# Altium project hotair.PrjPCB
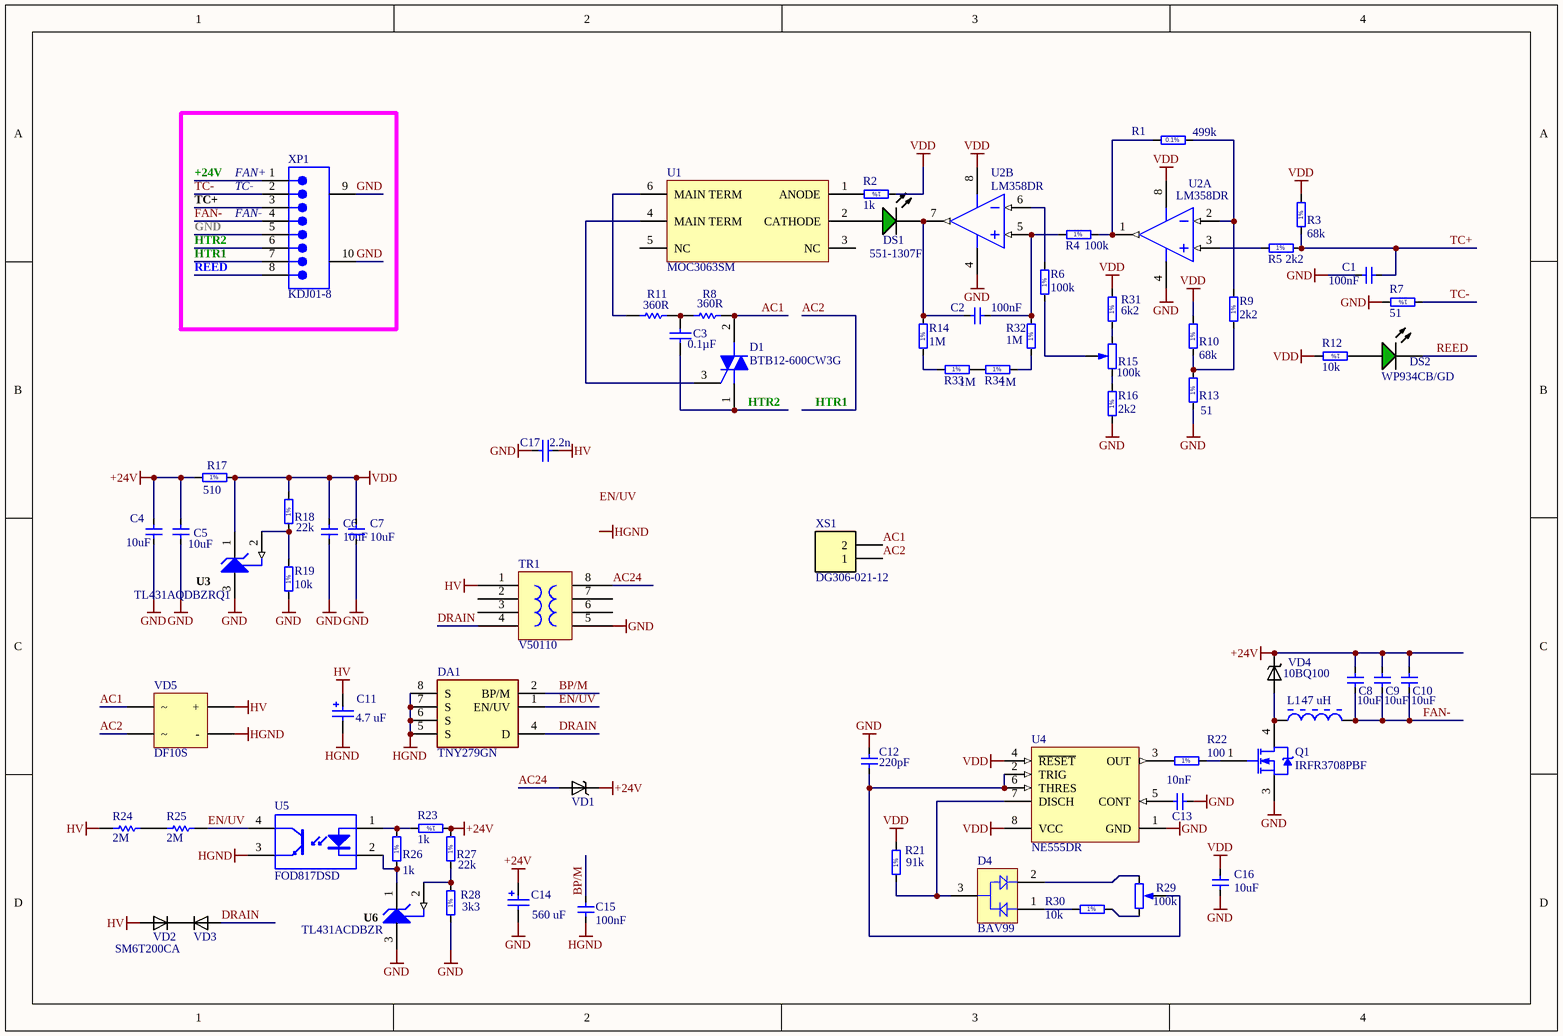
[diagram p0: hotair.SchDoc]
1 sheet, 71 parts. Net scope: global (net labels, ports and power ports of the same name join across sheets).
Board files: hotair.PcbDoc, hotair_panel.PcbDoc

## Sheet hotair.SchDoc
size A4

### Parts
C1  100nF  [CAP0805R]
C2  100nF  [CAP0805R]
C3  Capacitance: 0.1µF  [CAPA55-380X260]  (hidden comment: A104M15X7RF5TAA)
C4  10uF  [CAP0805R]
C5  10uF  [CAP0805R]
C6  10uF  [CAP0805R]
C7  10uF  [CAP0805R]
C8  10uF  [CAP1206R]
C9  10uF  [CAP1206R]
C10  10uF  [CAP1206R]
C11  value 4.7 uF  [WCAP-ATG8_8x11.5x3.5]  (hidden comment: 400 Vdc, 4.7 uF)
C12  220pF  [CAP0805R]
C13  10nF  [CAP0805R]
C14  value 560 uF  [WCAP-ATG8_8x11.5x3.5]  (hidden comment: 10 Vdc, 560 uF)
C15  100nF  [CAP0805R]
C16  10uF  [CAP0805R]
C17  value 2.2n  [CAP_Y]  (hidden comment: Y Capacitor)
D1  BTB12-600CW3G  [ONSC-TO-220-3-221A-07]
D4  BAV99  [INF-SOT23_L]
DA1  TNY279GN  [SMDIP8]
DS1  551-1307F  [DIAL-LED-551-2_V]
DS2  WP934CB/GD  [KING-WP934CBGD_V]
L1  Inductance: 47 uH  [COIL-RFB0807-2_V]  (hidden comment: RFB0807-470L)
Q1  IRFR3708PBF  [INTR-TO-252AA-3_M]
R1  499k  [RES0805R]
R2  1k  [RES0805R]
R3  68k  [RES0805R]
R4  100k  [RES0805R]
R5  2k2  [RES0805R]
R6  100k  [RES0805R]
R7  51  [RES0805R]
R8  360R  [RESC2010(5025)_L]
R9  2k2  [RES0805R]
R10  68k  [RES0805R]
R11  360R  [RESC2010(5025)_L]
R12  10k  [RES0805R]
R13  51  [RES0805R]
R14  1M  [RES0805R]
R15  100k  [CA9MH]
R16  2k2  [RES0805R]
R17  510  [RES0805R]
R18  22k  [RES0805R]
R19  10k  [RES0805R]
R21  91k  [RES0805R]
R22  100  [RES0805R]
R23  1k  [RES0805R]
R24  2M  [RESC1206(3216)_L]
R25  2M  [RESC1206(3216)_L]
R26  1k  [RES0805R]
R27  22k  [RES0805R]
R28  3k3  [RES0805R]
R29  100k  [CA9MH]
R30  10k  [RES0805R]
R31  6k2  [RES0805R]
R32  1M  [RES0805R]
R33  1M  [RES0805R]
R34  1M  [RES0805R]
TR1  V50110  [V50110]
U1  MOC3063SM  [FAIR-MDIP 6L-N06C_V]
U2  LM358DR  [D0008A_L]  (parts A,B of 2)
U3  TL431AQDBZRQ1  [DBZ0003A_M]
U4  NE555DR  [D0008A_M]
U5  FOD817DSD  [FAIR-MDIP-4_V]
U6  TL431ACDBZR  [DBZ0003A_L]
VD1  10BQ100  [DO-214AA]  (value not drawn)
VD2  SM6T200CA  [SMB]
VD3  US1M  [SMA]  (value not drawn)
VD4  10BQ100  [DO-214AA]
VD5  DF10S  [DF-S]
XP1  KDJ01-8  [KDJ01-8]
XS1  DG306-021-12  [DG306]

### Nets
+24V: C4.2 C5.2 C8.2 C9.2 C10.2 C14.1(P) R17.1 R23.1 R27.2 VD1.K VD4.K XP1.1
GND: C1.1 C4.1 C5.1 C6.1 C7.1 C12.2 C13.2 C14.2(N) C16.1 C17.1 Q1.3(S) R7.2 R13.1 R16.1 R19.1 R28.1 TR1.5 U2.4(GND) U3.3(ANODE) U4.1(GND) U6.3(ANODE) XP1.5 XP1.9 XP1.10
HGND: C11.2(N) C15.1 DA1.5(S) DA1.6(S) DA1.7(S) DA1.8(S) U5.3(EMITTER) VD5.2(-)
HV: C11.1(P) C17.2 R24.1 TR1.1 VD2.A VD5.1(+)
VDD: C6.2 C7.2 C16.2 R2.1 R3.2 R10.2 R12.2 R17.2 R18.2 R21.2 R31.2 U2.8(VCC) U3.1(CATHODE) U4.4(~{RESET}) U4.8(VCC)
AC1: D1.2(MT2) R8.2 VD5.4 XS1.2
AC2: VD5.3 XP1.7 XS1.1  [also labelled HTR1]
AC24: TR1.8 VD1.A
BP/M: C15.2 DA1.2(BP/M)
DRAIN: DA1.4(D) TR1.4 VD3.A
EN/UV: DA1.1(EN/UV) R25.2 U5.4(COLLECTOR)
FAN-: C8.1 C9.1 C10.1 L1.2 XP1.4
HTR2: C3.1 D1.1(MT1) XP1.6
REED: DS2.1(K) XP1.8
TC+: C1.2 R3.1 R5.2 XP1.3
TC-: R7.1 XP1.2
NetC2_1: C2.1 DS1.2(K) R14.2 U2.7(2OUT)
NetC2_2: C2.2 R4.1 R32.2 U2.5(2IN+)
NetC3_2: C3.2 R8.1 R11.2
NetC12_1: C12.1 R29.2 U4.2(TRIG) U4.6(THRES)
NetC13_1: C13.1 U4.5(CONT)
NetD1_3: D1.3(G) U1.4(MAIN_TERM)
NetD4_1: D4.1(A1) R30.1
NetD4_2: D4.2(K2) R29.1
NetD4_3: D4.3(C) R21.1 U4.7(DISCH)
NetDS1_1: DS1.1(A) U1.2(CATHODE)
NetDS2_2: DS2.2(A) R12.1
NetL1_1: L1.1 Q1.4(D) VD4.A
NetQ1_1: Q1.1(G) R22.2
NetR1_1: R1.1 R4.2 U2.1(1OUT)
NetR1_2: R1.2 R9.2 U2.2(1IN-)
NetR2_2: R2.2 U1.1(ANODE)
NetR5_1: R5.1 U2.3(1IN+)
NetR6_1: R6.1 R15.2
NetR6_2: R6.2 U2.6(2IN-)
NetR9_1: R9.1 R10.1 R13.2
NetR11_1: R11.1 U1.6(MAIN_TERM)
NetR14_1: R14.1 R33.1
NetR15_1: R15.1 R31.1
NetR15_3: R15.3 R16.2
NetR18_1: R18.1 R19.2 U3.2(REF)
NetR22_1: R22.1 U4.3(OUT)
NetR23_2: R23.2 R26.2 U5.1(ANODE)
NetR24_2: R24.2 R25.1
NetR26_1: R26.1 U5.2(CATHODE) U6.1(CATHODE)
NetR27_1: R27.1 R28.2 U6.2(REF)
NetR29_3: R29.3 R30.2
NetR32_1: R32.1 R34.2
NetR33_2: R33.2 R34.1
NetVD2_K: VD2.K VD3.K

Not connected (* = marked no-connect by the designer): TR1 2 3 6 7; U1 3(NC) 5(NC)

### Notes on the sheet
- (near XP1) FAN+
- (near XP1) TC-
- (near XP1) FAN-
- Labels drawn without touching a wire or pin: EN/UV, HGND
- (in symbol R0805_1K_1%_0.125W_100PPM) 1%
- (in symbol R0805_1M_1%_0.125W_100PPM) 1%
- (in symbol R0805_2K2_1%_0.125W_100PPM) 1%
- (in symbol R0805_3K3_1%_0.125W_100PPM) 1%
- (in symbol R0805_6K2_1%_0.125W_100PPM) 1%
- (in symbol R0805_10K_1%_0.125W_100PPM) 1%
- (in symbol R0805_22K_1%_0.125W_100PPM) 1%
- (in symbol R0805_51R_1%_0.125W_100PPM) 1%
- (in symbol R0805_68K_1%_0.125W_100PPM) 1%
- (in symbol R0805_91K_1%_0.125W_100PPM) 1%
- (in symbol R0805_100K_1%_0.125W_100PPM) 1%
- (in symbol R0805_100R_1%_0.125W_100PPM) 1%
- (in symbol R0805_499K_0.1%_0.125W_25PPM) 0.1%
- (in symbol R0805_510R_1%_0.125W_100PPM) 1%

### Library data of the parts
C1 C2 C15 = CC0805_100NF_50V_10%_X7R: Part Description: SMD Multilayer Chip Ceramic Capacitor; Manufacturer: GENERIC; Manufacturer1 Part Number: B37941K5104K62; Voltage: 50V; TC: X7R; Tolerance: ±10%; Table: Capacitors SMD; Part Number: CC0805_100NF_50V_10%_X7R; Component Kind: Standard; Component Type: Standard; Pin Count: 2; Value: 100nF; Status: Preferred; Manufacturer Part Number: CC0805_100NF_50V_10%_X7R; Case: 0805; Mounted: Yes; Socket: No; SMD: Yes; Manufacturer1 Example: EPCOS; Manufacturer1 ComponentHeight: 1.35mm; HelpURL: \\cern.ch\dfs\Applications\Altium\Datasheets\CC0805_X7R_EPCOS.pdf; Author: I. Kuznetsov; CreateDate: 03.12.2007; LatestRevisionDate: 03.12.2007; Manufacturer Part Number 2: CC0805KPX7R9BB104
C3 = CMP-2000-05716-1: Axial Leaded Multilayer Ceramic Capacitor for General Purpose, 50 VDC, 100 nF, +/- 20%, -55 to 125 degC, 2-Pin THD, RoHS, Tape and Reel; Manufacturer: Vishay; Voltage - Rated: 50V; Temperature Coefficient: X7R; Lead Spacing: -; Lead Style: -; Height - Seated (Max): -; Standard Package: 7,000; Datasheet Version: 08/2013; Datasheet URL: http://www.vishay.com/docs/45164/aseries.pdf; Package Description: 2-Pin Axial Lead, Dia 2.6 mm, Body Length 3.8 mm; Manufacturer URL: http://www.vishay.com/; Category: Capacitors; Mounting Technology: ThroughHole; Size / Dimension: 0.098"Diax0.150"L(2.50mmx3.80mm); Packaging: Tape&Reel(TR); Family: CeramicCapacitors; Applications: GeneralPurpose; Package Reference: CAPA55-380X260; Thickness (Max): -; Series: A; Features: -; Ratings: -; Mounting Type: ThroughHole; Operating Temperature: -55°C~125°C; Tolerance: ±20%; Package / Case: Axial
C4-C7 C16 = CC0805_10UF_25V_10%_X5R: Part Description: SMD Multilayer Chip Ceramic Capacitor; Manufacturer: GENERIC; Manufacturer1 Part Number: C2012X5R1E106K125AB; Voltage: 25V; TC: X5R; Tolerance: ±10%; Table: Capacitors SMD; Part Number: CC0805_10UF_25V_10%_X5R; Component Kind: Standard; Component Type: Standard; Pin Count: 2; Value: 10uF; Status: Preferred; Manufacturer Part Number: CC0805_10UF_25V_10%_X5R; Case: 0805; Mounted: Yes; Socket: No; SMD: Yes; Manufacturer1 Example: TDK; Manufacturer1 ComponentHeight: 1.4mm; HelpURL: \\cern.ch\dfs\Applications\Altium\Datasheets\CC0805_X5R_TDK_C.pdf; Author: I. Kuznetsov; CreateDate: 25.10.2012; LatestRevisionDate: 25.10.2012; Manufacturer Part Number 2: CC0805KKX5R8BB106
C8-C10 = CC1206_10UF_10V_10%_X7R: Part Description: SMD Multilayer Chip Ceramic Capacitor; Manufacturer: GENERIC; Manufacturer1 Part Number: C1206C106K8RAC; Voltage: 10V; TC: X7R; Tolerance: ±10%; Table: Capacitors SMD; Part Number: CC1206_10UF_10V_10%_X7R; Component Kind: Standard; Component Type: Standard; Pin Count: 2; Value: 10uF; Status: Preferred; Manufacturer Part Number: CC1206_10uF_10V_10%_X7R; Case: 1206; Mounted: Yes; Socket: No; SMD: Yes; Manufacturer1 Example: KEMET; Manufacturer1 ComponentHeight: 1.8mm; HelpURL: \\cern.ch\dfs\Applications\Altium\Datasheets\CC1206_X7R_KEMET.pdf; Author: I. Kuznetsov; CreateDate: 03.12.2007; LatestRevisionDate: 03.12.2007; Manufacturer Part Number 2: CC1206KKX7R6BB106
C11 = 860011374005: WCAP-ATG8 Aluminum Electrolytic Capacitors, 8x11.5mm, 400 Vdc, 4.7 uF; Rated Voltage: 400 Vdc; ComponentLink1Description: Manufacturer; ComponentLink1URL: http://www.we-online.de; ComponentLink2Description: Datasheet; ComponentLink2URL: http://katalog.we-online.de/pbs/datasheet/860011374005.pdf; Part Number: 860011374005; Published Date: Sep. 2017; Publisher: Wurth Elektronik; Size: 8x11.5mm; Life Cycle: 2000h; Operating Temperature: -25 °C up to +85 °C
C12 = CC0805_220PF_50V_5%_NP0: Part Description: SMD Multilayer Chip Ceramic Capacitor; Manufacturer: GENERIC; Manufacturer1 Part Number: B37940K5221J060; Voltage: 50V; TC: NP0; Tolerance: ±5%; Table: Capacitors SMD; Part Number: CC0805_220PF_50V_5%_NP0; Component Kind: Standard; Component Type: Standard; Pin Count: 2; Value: 220pF; Status: Preferred; Manufacturer Part Number: CC0805_220PF_50V_5%_NP0; Case: 0805; Mounted: Yes; Socket: No; SMD: Yes; Manufacturer1 Example: EPCOS; Manufacturer1 ComponentHeight: 1.30mm; HelpURL: \\cern.ch\dfs\Applications\Altium\Datasheets\CC0805_NP0_EPCOS.pdf; Author: I. Kuznetsov; CreateDate: 03.12.2007; LatestRevisionDate: 03.12.2007; Manufacturer Part Number 2: CC0805JRNPO9BN221
C13 = CC0805_10NF_250V_10%_X7R: Part Description: SMD Multilayer Chip Ceramic Capacitor; Manufacturer: GENERIC; Manufacturer1 Part Number: C0805C103KARACTU; Voltage: 250V; TC: X7R; Tolerance: ±10%; Table: Capacitors SMD; Part Number: CC0805_10NF_250V_10%_X7R; Component Kind: Standard; Component Type: Standard; Pin Count: 2; Value: 10nF; Status: None; Manufacturer Part Number: CC0805_10NF_250V_10%_X7R; Case: 0805; Mounted: Yes; Socket: No; SMD: Yes; Manufacturer1 Example: KEMET; Manufacturer1 ComponentHeight: 0.88mm; HelpURL: \\cern.ch\dfs\Applications\Altium\Datasheets\CC0805_X7R_KEMET.pdf; Author: I. Kuznetsov; CreateDate: 24.06.2013; LatestRevisionDate: 24.06.2013; Manufacturer Part Number 2: CC0805KKX7RYBB103
C14 = 860010274012: WCAP-ATG8 Aluminum Electrolytic Capacitors, 8x11.5mm, 10 Vdc, 560 uF; Rated Voltage: 10 Vdc; ComponentLink1Description: Manufacturer; ComponentLink1URL: http://www.we-online.de; ComponentLink2Description: Datasheet; ComponentLink2URL: http://katalog.we-online.de/pbs/datasheet/860010274012.pdf; Part Number: 860010274012; Published Date: Sep. 2017; Publisher: Wurth Elektronik; Size: 8x11.5mm; Life Cycle: 2000h; Operating Temperature: -40 °C up to +85 °C
C17 = CAP_Y: PartNumber: Y Film Capacitor; Voltage: 1000V
D1 = CMP-1070-00036-1: Triacs, Silicon Bidirectional Thyristor, 3-Pin TO-220, Pb-Free, Tube; Manufacturer: On Semiconductor; IT(RMS) Max (A): 12; ITSM Max (A): 120; IGT Max (mA): 35; PackageDescription: 3-Pin Flange Mount, Vertical Straight Lead, Body 9.97 x 4.445 mm, Pitch 2.54 mm; ComponentLink2Description: Datasheet; PartNumber: BTB12-600CW3G; ComponentLink2URL: http://www.onsemi.com/pub_link/Collateral/BTB12-600CW3-D.PDF; ComponentLink3Description: Package Specification; Packing: Tube; ComponentLink3URL: http://www.onsemi.com/pub_link/Collateral/221A-07.PDF; ComponentLink1Description: Manufacturer URL; Mounting Technology: Through Hole; RoHS: Pb-Free; PackageVersion: Rev. O, 07/2008; DatasheetVersion: Rev. 1; ComponentLink1URL: http://www.onsemi.com/; PackageReference: TO-220-3-221A-07
D4 = CMP-1176-00014-1: Silicon Switching Diode, SOT23, Reel, Green; Manufacturer: Infineon; Green: TRUE; Mounting Technology: Surface Mount; ComponentLink3URL: http://www.infineon.com/dgdl/smbta14_mmbta14.pdf?folderId=db3a30431441fb5d011445c30f210183&fileId=db3a30431441fb5d011445ef0201018c; PartNumber: BAV99; ComponentLink2Description: Datasheet; ComponentLink2URL: http://www.infineon.com/dgdl/bav99series.pdf?folderId=db3a30431400ef6801141b5844e103ea&fileId=db3a30431400ef6801141c1b237d042f; PackageVersion: Apr-08; PackageDescription: 3-Pin Small Outline Transistor Package, 1.3 x 2.9 mm Body, 0.95 mm Pitch; RevisionNote: Re-Activated Devices; ComponentLink1URL: http://www.infineon.com/; PackageReference: SOT23; ComponentLink1Description: Manufacturer URL; ComponentLink3Description: Package Specification; Packing: Reel
DA1 = TNY279GN: Table: Power; Part Number: TNY279GN; Device: TNY279GN
DS1 = CMP-2000-05095-1: 3mm LED Circuit Board Indicator .200' High LED Centerline, GREEN, 1.9 V, 2 mA, 2-Pin THD, RoHS, Bulk; Manufacturer: Dialight; Product Length (mm): 8.89mm; Number of Elements: 1; Lum Intensity: 1.6mcd; Reverse Voltage: 5V; Test Current (It): 2mA; Peak Wavelength: 565nm; DELETED: Compliant; Viewing Angle: 60deg; Rad Hardened: No; Product Depth (mm): 4.32mm; Power Dissipation: 20W; Emitting Color: YellowGreen; Forward Current: 7mA; Shape Type: Circular; Forward Voltage: 2.2V; Main Category: StandardLED; Product Height (mm): 7.11mm; Lens Type: Diffused; Type: Uni-Color; Manufacturer URL: http://www.dialight.com; Datasheet Version: Jul-02; Luminous Intensity: 1.6mcd; Lens Dimensions: 2.89x2.89x2.54mm; Mounting: ThroughHole; Datasheet URL: http://datasheet.octopart.com/551-1307F-Dialight-datasheet-2832.pdf; High Brightness: No; Pin Count: 2; Operating Temperature Classification: Industrial; Packaging: Bulk; Operating Temp Range: -55Cto100C
DS2 = CMP-2000-07417-1: Right Angle LED Indicator, 62.5 mW, 25 mA, -40 to 85 degC, 2-Pin THD, RoHS, Bulk; Manufacturer: Kingbright; Voltage Rating: 2.2V; Configuration: Single; Other Names: 754-1297 / WP934CBGD; Lens Style/Size: RoundwithDomedTop,3mm; Catalog Drawings: WP934CBSeriesFront / WP934CBSeriesSide; Millicandela Rating: 22.5mcd; Minimum Quantity: Green; 3D Model: WP934CB/x.sldprt / WP934CB/x.pro / WP934CB/x.igs / WP934CB/x.stp; Wavelength - Peak: 568nm; Lens Type: Diffused,Tinted; Dynamic Catalog: SingleLevel3mm(T1)SingleColorRightAngleLEDs; Viewing Angle: 40°; Current: 20mA; Packaging: Bulk; Package Reference: WP934CBGD; Datasheet Version: Rev. 10B, 09/2016; Family: LEDs-CircuitBoardIndicators,Arrays,LightBars,BarGraphs; Manufacturer URL: http://www.kingbright.com/; Standard Package: 500; Mounting Technology: ThroughHole; Quantity Available: Bulk; Category: Optoelectronics; Color: Green; Package Description: 2-Pin Through Hole Device, Body 4.6 x 8.75 mm; Mounting Type: ThroughHole,RightAngle; Datasheet URL: http://www.kingbrightusa.com/images/catalog/SPEC/WP934CB-GD.pdf
L1 = CMP-0924-00047-1: Power Inductor, 47 uH +/- 10%, 1.45 A, -40 to 125 degC, 2-Pin Radial Leaded, Dia 8.8 mm, RoHS, Tray; Manufacturer: Coilcraft; DCR: 0.19 Ohm Max.; Tolerance: +/- 10%; Irms Rise (20 degC): 1.3 A; Isat: 1.45 A; Irms Rise (40 degC): 1.85 A; SRF: 12 MHz Typ.; Mounting Technology: Through Hole; ComponentLink2URL: http://www.coilcraft.com/pdfs/rfb.pdf; PackageDescription: 2-Pin Radial Leaded, Dia 8.8 mm, Height 7.5 mm, Pin Spacing 5 mm; RoHS: TRUE; DatasheetVersion: Sep-13; Packing: Tray; Ambient Temperature Range: -40 to 125 degC; ComponentLink2Description: Datasheet; PartNumber: RFB0807-470L; PackageReference: RFB0807-2; ComponentLink1Description: Manufacturer URL; ComponentLink1URL: http://www.coilcraft.com/
Q1 = CMP-2000-05156-1: Mosfet N-Channel, 30 V, 61 A, -55 to 175 degC, 3-Pin DPAK, RoHS, Tube; Manufacturer: International Rectifier; Voltage Vds Typ: 30V; Power Dissipation Pd: 87W; Rds(on) Test Voltage Vgs: 10V; Transistor Polarity: NChannel; Threshold Voltage Vgs Typ: 2V; Pulse Current Idm: 244A; Junction to Case Thermal Resistance A: 1.73degC/W; On Resistance Rds(on): 13mohm; No. of Pins: 3; Alternate Case Style: D-PAK; On State resistance @ Vgs = 10V: 12.5mohm; SVHC: NoSVHC(19-Dec-2012); Continuous Drain Current Id: 61A; Transistor Case Style: TO-252; Package Reference: TO-252AA-3; Drain Source Voltage Vds: 30V; Datasheet URL: http://www.irf.com/product-info/datasheets/data/irfr3708pbf.pdf; Voltage Vgs Rds on Measurement: 10V; Operating Temperature Min: -55degC; MSL: –; Manufacturer URL: http://internationalrectifier.com/; Voltage Vgs Max: 2V; Operating Temperature Range: -55degCto+175degC; Current Id Max: 61A; Operating Temperature Max: 175degC; Package / Case: DPAK; Package Description: 3-Pin Surface Mount Device, Body 6.54 x 6.095 mm, Pitch 2.29 mm; Datasheet Version: Dec-04
R1 = R0805_499K_0.1%_0.125W_25PPM: Part Description: Thin Film Chip Resistor; Manufacturer: GENERIC; Manufacturer1 Part Number: ERA6AEB4993V; Power: 0.125W; TC: ±25ppm; Tolerance: ±0.1%; Table: Resistors SMD; Part Number: R0805_499K_0.1%_0.125W_25PPM; Component Kind: Standard; Component Type: Standard; Footprint: RESC2012X60N; PackageDescription: Standard; Pin Count: 2; Value: 499k; Status: Not recommended; Manufacturer Part Number: R0805_499K_0.1%_0.125W_25PPM; Case: 0805; Mounted: Yes; Socket: No; SMD: Yes; Manufacturer1 Example: PANASONIC; Manufacturer1 ComponentHeight: 0.6mm; HelpURL: \\cern.ch\dfs\Applications\Altium\Datasheets\R0805_PANASONIC_ERA.pdf; Author: CERN DEM JLC; CreateDate: 20.06.2011; LatestRevisionDate: 20.06.2011
R2 R23 R26 = R0805_1K_1%_0.125W_100PPM: Part Description: General Purpose Thick Film Chip Resistor; Manufacturer: GENERIC; Manufacturer1 Part Number: NRC10F1001TRF; Power: 0.125W; TC: ±100ppm/°C; Tolerance: ±1%; Table: Resistors SMD; Part Number: R0805_1K_1%_0.125W_100PPM; Component Kind: Standard; Component Type: Standard; Footprint: RESC2012X60N; PackageDescription: Standard; Pin Count: 2; Value: 1k; Status: Preferred; Manufacturer Part Number: R0805_1K_1%_0.125W_100PPM; Case: 0805; Mounted: Yes; Socket: No; SMD: Yes; Manufacturer1 Example: NIC COMPONENT; Manufacturer1 ComponentHeight: 0.6mm; HelpURL: \\cern.ch\dfs\Applications\Altium\Datasheets\R0805_NIC_NRC.pdf; Author: CERN DEM JLC; CreateDate: 03.12.2007; LatestRevisionDate: 13.03.2008
R3 R10 = R0805_68K_1%_0.125W_100PPM: Part Description: General Purpose Thick Film Chip Resistor; Manufacturer: GENERIC; Manufacturer1 Part Number: NRC10F6802TRF; Power: 0.125W; TC: ±100ppm/°C; Tolerance: ±1%; Table: Resistors SMD; Part Number: R0805_68K_1%_0.125W_100PPM; Component Kind: Standard; Component Type: Standard; Footprint: RESC2012X60N; PackageDescription: Standard; Pin Count: 2; Value: 68k; Status: Preferred; Manufacturer Part Number: R0805_68K_1%_0.125W_100PPM; Case: 0805; Mounted: Yes; Socket: No; SMD: Yes; Manufacturer1 Example: NIC COMPONENT; Manufacturer1 ComponentHeight: 0.6mm; HelpURL: \\cern.ch\dfs\Applications\Altium\Datasheets\R0805_NIC_NRC.pdf; Author: CERN DEM JLC; CreateDate: 03.12.2007; LatestRevisionDate: 13.03.2008
R4 R6 = R0805_100K_1%_0.125W_100PPM: Part Description: General Purpose Thick Film Chip Resistor; Manufacturer: GENERIC; Manufacturer1 Part Number: NRC10F1003TRF; Power: 0.125W; TC: ±100ppm/°C; Tolerance: ±1%; Table: Resistors SMD; Part Number: R0805_100K_1%_0.125W_100PPM; Component Kind: Standard; Component Type: Standard; Footprint: RESC2012X60N; PackageDescription: Standard; Pin Count: 2; Value: 100k; Status: Preferred; Manufacturer Part Number: R0805_100K_1%_0.125W_100PPM; Case: 0805; Mounted: Yes; Socket: No; SMD: Yes; Manufacturer1 Example: NIC COMPONENT; Manufacturer1 ComponentHeight: 0.6mm; HelpURL: \\cern.ch\dfs\Applications\Altium\Datasheets\R0805_NIC_NRC.pdf; Author: CERN DEM JLC; CreateDate: 03.12.2007; LatestRevisionDate: 13.03.2008
R5 R9 R16 = R0805_2K2_1%_0.125W_100PPM: Part Description: General Purpose Thick Film Chip Resistor; Manufacturer: GENERIC; Manufacturer1 Part Number: NRC10F2201TRF; Power: 0.125W; TC: ±100ppm/°C; Tolerance: ±1%; Table: Resistors SMD; Part Number: R0805_2K2_1%_0.125W_100PPM; Component Kind: Standard; Component Type: Standard; Footprint: RESC2012X60N; PackageDescription: Standard; Pin Count: 2; Value: 2k2; Status: Preferred; Manufacturer Part Number: R0805_2K2_1%_0.125W_100PPM; Case: 0805; Mounted: Yes; Socket: No; SMD: Yes; Manufacturer1 Example: NIC COMPONENT; Manufacturer1 ComponentHeight: 0.6mm; HelpURL: \\cern.ch\dfs\Applications\Altium\Datasheets\R0805_NIC_NRC.pdf; Author: CERN DEM JLC; CreateDate: 03.12.2007; LatestRevisionDate: 13.03.2008
R7 R13 = R0805_51R_1%_0.125W_100PPM: Part Description: General Purpose Thick Film Chip Resistor; Manufacturer: GENERIC; Manufacturer1 Part Number: NRC10F51R0TRF; Power: 0.125W; TC: ±100ppm/°C; Tolerance: ±1%; Table: Resistors SMD; Part Number: R0805_51R_1%_0.125W_100PPM; Component Kind: Standard; Component Type: Standard; Footprint: RESC2012X60N; PackageDescription: Standard; Pin Count: 2; Value: 51; Status: Preferred; Manufacturer Part Number: R0805_51R_1%_0.125W_100PPM; Case: 0805; Mounted: Yes; Socket: No; SMD: Yes; Manufacturer1 Example: NIC COMPONENT; Manufacturer1 ComponentHeight: 0.6mm; HelpURL: \\cern.ch\dfs\Applications\Altium\Datasheets\R0805_NIC_NRC.pdf; Author: CERN DEM JLC; CreateDate: 03.12.2007; LatestRevisionDate: 13.03.2008
R8 R11 = CMP-1017-00459-1: 360R 0.75W 1% 2010 (5025 Metric)  SMD; Case-EIA: 2010; Value: 360.00 Ohm; Case-Metric: 5025; Technology: SMT; Power: 0.75 W; Tolerance: 1 %
R12 R19 R30 = R0805_10K_1%_0.125W_100PPM: Part Description: General Purpose Thick Film Chip Resistor; Manufacturer: GENERIC; Manufacturer1 Part Number: NRC10F1002TRF; Power: 0.125W; TC: ±100ppm/°C; Tolerance: ±1%; Table: Resistors SMD; Part Number: R0805_10K_1%_0.125W_100PPM; Component Kind: Standard; Component Type: Standard; Footprint: RESC2012X60N; PackageDescription: Standard; Pin Count: 2; Value: 10k; Status: Preferred; Manufacturer Part Number: R0805_10K_1%_0.125W_100PPM; Case: 0805; Mounted: Yes; Socket: No; SMD: Yes; Manufacturer1 Example: NIC COMPONENT; Manufacturer1 ComponentHeight: 0.6mm; HelpURL: \\cern.ch\dfs\Applications\Altium\Datasheets\R0805_NIC_NRC.pdf; Author: CERN DEM JLC; CreateDate: 03.12.2007; LatestRevisionDate: 13.03.2008
R14 R32-R34 = R0805_1M_1%_0.125W_100PPM: Part Description: General Purpose Thick Film Chip Resistor; Manufacturer: GENERIC; Manufacturer1 Part Number: NRC10F1004TRF; Power: 0.125W; TC: ±100ppm/°C; Tolerance: ±1%; Table: Resistors SMD; Part Number: R0805_1M_1%_0.125W_100PPM; Component Kind: Standard; Component Type: Standard; Footprint: RESC2012X60N; PackageDescription: Standard; Pin Count: 2; Value: 1M; Status: Preferred; Manufacturer Part Number: R0805_1M_1%_0.125W_100PPM; Case: 0805; Mounted: Yes; Socket: No; SMD: Yes; Manufacturer1 Example: NIC COMPONENT; Manufacturer1 ComponentHeight: 0.6mm; HelpURL: \\cern.ch\dfs\Applications\Altium\Datasheets\R0805_NIC_NRC.pdf; Author: CERN DEM JLC; CreateDate: 03.12.2007; LatestRevisionDate: 13.03.2008
R15 R29 = CA9MH: Part Number: CA9MH; Value: 100k; Component Kind: Standard; Component Type: Standard; Pin Count: 3
R17 = R0805_510R_1%_0.125W_100PPM: Part Description: General Purpose Thick Film Chip Resistor; Manufacturer: GENERIC; Manufacturer1 Part Number: NRC10F5100TRF; Power: 0.125W; TC: ±100ppm/°C; Tolerance: ±1%; Table: Resistors SMD; Part Number: R0805_510R_1%_0.125W_100PPM; Component Kind: Standard; Component Type: Standard; Footprint: RESC2012X60N; PackageDescription: Standard; Pin Count: 2; Value: 510; Status: Preferred; Manufacturer Part Number: R0805_510R_1%_0.125W_100PPM; Case: 0805; Mounted: Yes; Socket: No; SMD: Yes; Manufacturer1 Example: NIC COMPONENT; Manufacturer1 ComponentHeight: 0.6mm; HelpURL: \\cern.ch\dfs\Applications\Altium\Datasheets\R0805_NIC_NRC.pdf; Author: CERN DEM JLC; CreateDate: 03.12.2007; LatestRevisionDate: 13.03.2008
R18 R27 = R0805_22K_1%_0.125W_100PPM: Part Description: General Purpose Thick Film Chip Resistor; Manufacturer: GENERIC; Manufacturer1 Part Number: NRC10F2202TRF; Power: 0.125W; TC: ±100ppm/°C; Tolerance: ±1%; Table: Resistors SMD; Part Number: R0805_22K_1%_0.125W_100PPM; Component Kind: Standard; Component Type: Standard; Footprint: RESC2012X60N; PackageDescription: Standard; Pin Count: 2; Value: 22k; Status: Preferred; Manufacturer Part Number: R0805_22K_1%_0.125W_100PPM; Case: 0805; Mounted: Yes; Socket: No; SMD: Yes; Manufacturer1 Example: NIC COMPONENT; Manufacturer1 ComponentHeight: 0.6mm; HelpURL: \\cern.ch\dfs\Applications\Altium\Datasheets\R0805_NIC_NRC.pdf; Author: CERN DEM JLC; CreateDate: 03.12.2007; LatestRevisionDate: 13.03.2008
R21 = R0805_91K_1%_0.125W_100PPM: Part Description: General Purpose Thick Film Chip Resistor; Manufacturer: GENERIC; Manufacturer1 Part Number: NRC10F9102TRF; Power: 0.125W; TC: ±100ppm/°C; Tolerance: ±1%; Table: Resistors SMD; Part Number: R0805_91K_1%_0.125W_100PPM; Component Kind: Standard; Component Type: Standard; Footprint: RESC2012X60N; PackageDescription: Standard; Pin Count: 2; Value: 91k; Status: Preferred; Manufacturer Part Number: R0805_91K_1%_0.125W_100PPM; Case: 0805; Mounted: Yes; Socket: No; SMD: Yes; Manufacturer1 Example: NIC COMPONENT; Manufacturer1 ComponentHeight: 0.6mm; HelpURL: \\cern.ch\dfs\Applications\Altium\Datasheets\R0805_NIC_NRC.pdf; Author: CERN DEM JLC; CreateDate: 03.12.2007; LatestRevisionDate: 13.03.2008
R22 = R0805_100R_1%_0.125W_100PPM: Part Description: General Purpose Thick Film Chip Resistor; Manufacturer: GENERIC; Manufacturer1 Part Number: NRC10F4700TRF; Power: 0.125W; TC: ±100ppm/°C; Tolerance: ±1%; Table: Resistors SMD; Part Number: R0805_100R_1%_0.125W_100PPM; Component Kind: Standard; Component Type: Standard; Footprint: RESC2012X60N; PackageDescription: Standard; Pin Count: 2; Value: 100; Status: Preferred; Manufacturer Part Number: R0805_100R_1%_0.125W_100PPM; Case: 0805; Mounted: Yes; Socket: No; SMD: Yes; Manufacturer1 Example: NIC COMPONENT; Manufacturer1 ComponentHeight: 0.6mm; HelpURL: \\cern.ch\dfs\Applications\Altium\Datasheets\R0805_NIC_NRC.pdf; Author: CERN DEM JLC; CreateDate: 03.12.2007; LatestRevisionDate: 13.03.2008
R24 R25 = CMP-1014-00153-1: 2M 0.25W 5% 1206 (3216 Metric)  SMD; Value: 2000000.00 Ohm; Case-EIA: 1206; Case-Metric: 3216; Technology: SMT; Power: 0.25 W; Tolerance: 5 %
R28 = R0805_3K3_1%_0.125W_100PPM: Part Description: General Purpose Thick Film Chip Resistor; Manufacturer: GENERIC; Manufacturer1 Part Number: NRC10F3301TRF; Power: 0.125W; TC: ±100ppm/°C; Tolerance: ±1%; Table: Resistors SMD; Part Number: R0805_3K3_1%_0.125W_100PPM; Component Kind: Standard; Component Type: Standard; Footprint: RESC2012X60N; PackageDescription: Standard; Pin Count: 2; Value: 3k3; Status: Preferred; Manufacturer Part Number: R0805_3K3_1%_0.125W_100PPM; Case: 0805; Mounted: Yes; Socket: No; SMD: Yes; Manufacturer1 Example: NIC COMPONENT; Manufacturer1 ComponentHeight: 0.6mm; HelpURL: \\cern.ch\dfs\Applications\Altium\Datasheets\R0805_NIC_NRC.pdf; Author: CERN DEM JLC; CreateDate: 03.12.2007; LatestRevisionDate: 13.03.2008
R31 = R0805_6K2_1%_0.125W_100PPM: Part Description: General Purpose Thick Film Chip Resistor; Manufacturer: GENERIC; Manufacturer1 Part Number: NRC10F6201TRF; Power: 0.125W; TC: ±100ppm/°C; Tolerance: ±1%; Table: Resistors SMD; Part Number: R0805_6K2_1%_0.125W_100PPM; Component Kind: Standard; Component Type: Standard; Footprint: RESC2012X60N; PackageDescription: Standard; Pin Count: 2; Value: 6k2; Status: Preferred; Manufacturer Part Number: R0805_6K2_1%_0.125W_100PPM; Case: 0805; Mounted: Yes; Socket: No; SMD: Yes; Manufacturer1 Example: NIC COMPONENT; Manufacturer1 ComponentHeight: 0.6mm; HelpURL: \\cern.ch\dfs\Applications\Altium\Datasheets\R0805_NIC_NRC.pdf; Author: CERN DEM JLC; CreateDate: 03.12.2007; LatestRevisionDate: 13.03.2008
U1 = CMP-1643-00001-1: Zero-Cross Triac Driver Optocoupler (600 Volt Peak), 60 mA, 250 mW, -40 to 85 degC, 6-Pin MDIP 6L-N06C, RoHS, Tube; VF: 1.3 V; Power Dissipation Max: 250 mW; Forward Current: 60 mA; IR: 0.005 uA; PackageDescription: 6-Pin Small Outline Package, Body 8.51 x 6.35 mm, Pitch 2.54 mm; ComponentLink3URL: http://www.fairchildsemi.com/package-drawings/N0/N06C.pdf; ComponentLink3Description: Package Specification; ComponentLink2Description: Datasheet; ComponentLink2URL: http://www.fairchildsemi.com/datasheets/MO/MOC3063M.pdf; Mounting Technology: Surface Mount; Generic Part Number: MOC3063; ComponentLink1Description: Manufacturer URL; Packing: Tube; Temperature Min: -40 degC; Temperature Max: 85 degC; ComponentLink1URL: http://www.fairchildsemi.com/; RoHS: TRUE; PartNumber: MOC3063SM; DatasheetVersion: Rev. 1.5
U2 = CMP-1685-00009-1: Dual Operational Amplifier, 3 to 32 V, 0 to 70 degC, 8-Pin SOIC (D), Green (RoHS & no Sb/Br), Tape and Reel; DatasheetVersion: SLOS068T, 04/2015; ComponentLink1URL: http://www.ti.com/; ComponentLink2URL: http://www.ti.com/lit/ds/symlink/lm358.pdf; ComponentLink3Description: Package Specification; Code_JEDEC: MS-012; PackageDescription: 8-Pin Small Outline Integrated Circuit, Body 4.9 x 3.9 mm, Pitch 1.27 mm; ComponentLink2Description: Datasheet; PackageVersion: 4040047-3/M, 06/2011; ComponentLink1Description: Manufacturer URL; ComponentLink3URL: http://www.ti.com/lit/ml/msoi002j/msoi002j.pdf; PackageReference: D0008A
U3 = CMP-0366-01226-2: Automotive Catalog Adjustable Precision Shunt Regulator, 34 ppm / degC, 100 mA, -40 to 125 degC, 3-pin SOT-23 (DBZ), Green (RoHS & no Sb/Br); Manufacturer: Texas Instruments; Iout/Iz(Max)(mA): 100; VO Adj(Max)(V): 36; SubFamily: Shunt Voltage Reference; VO Adj(Min)(V): 2.495; Initial Accuracy @ 25/deg C(%): 1; Min Iz for Regulation(uA): 600; Temp Coeff(Typ)(ppm/ degree C): 34; ComponentLink3Description: Package Specification; ComponentLink3URL: http://www.ti.com/litv/pdf/mpds108a; PackageVersion: 4203227/B; PartNumber: TL431AQDBZRQ1; Eco-Plan: Green (RoHS & no Sb/Br); Code_JEDEC: TO-236; PackageReference: DBZ0003A; ComponentLink2Description: Datasheet; ComponentLink1URL: http://www.ti.com/; Rating: Automotive; PackageDescription: 3-Pin Plastic Small Outline, Body 2.92 x 1.3 mm, Pitch 0.95 mm; ComponentLink1Description: Manufacturer URL; DatasheetVersion: SGLS302C; ComponentLink2URL: http://www.ti.com/general/docs/lit/getliterature.tsp?genericPartNumber=TL431A-Q1&fileType=pdf; Mounting Technology: Surface Mount
U4 = CMP-1685-00007-1: Precision Timer, 4.5 to 16 V, 0 to 70 degC, 8-Pin SOIC (D8), Green (RoHS & no Sb/Br), Tape and Reel; Forward Voltage: 450 mV; Forward Current: 1 A; Max Surge Current: 30 A; Peak Reverse Current: 500 uA; Case\Package: SMA; PackageReference: D0008A; Width: 2.84 mm; PackageDescription: 8-Pin Small Outline Integrated Circuit, Body 4.9 x 3.9 mm, Pitch 1.27 mm; DatasheetVersion: SLFS022I, 09/2014; ComponentLink2Description: Datasheet; Package Quantity: 1; REACH SVHC: Unknown; Radiation Hardening: No; Height: 2.44 mm; Code_JEDEC: MS-012; Pins: 2; ComponentLink1Description: Manufacturer URL; ComponentLink3Description: Package Specification; ComponentLink3URL: http://www.ti.com/lit/ml/msoi002j/msoi002j.pdf; Length: 4.57 mm; ComponentLink1URL: http://www.ti.com/; Mount: Surface Mount; PackageVersion: 4040047-3/M, 06/2011; ComponentLink2URL: http://www.ti.com/general/docs/lit/getliterature.tsp?genericPartNumber=NE555&fileType=pdf; RoHSCompliant: true; Max Operating Temperature: 125 degC; Packaging: Cut Tape; Min Operating Temperature: -55 degC
U5 = CMP-2000-06281-1: Phototransistor Optocoupler, 4 us Rise, 3 us Fall, 5000 Vrms, -55 to 110 degC, 4-Pin MDIP, RoHS, Tape and Reel; Manufacturer: Fairchild Semiconductor; Current Transfer Ratio (Min): 300%@5mA; Rise / Fall Time (Typ): 4µs,3µs; Vce Saturation (Max): 200mV; Current Transfer Ratio (Max): 600%@5mA; Package Version: 10/2014; Current - DC Forward (If) (Max): 50mA; Online Catalog: FOD617,814,817Series; Voltage - Output (Max): 70V; Number of Channels: 1; Input Type: DC; Voltage - Forward (Vf) (Typ): 1.2V; Other Names: FOD817DSDDKR; Output Type: Transistor; Packaging: Digi-Reel®; Category: Isolators; Package / Case: 4-SMD,GullWing; Voltage - Isolation: 5000Vrms; Mounting Technology: SurfaceMount; Series: -; Mounting Type: SurfaceMount; Supplier Device Package: 4-SMD; Family: Optoisolators-Transistor,PhotovoltaicOutput; Standard Package: 1; Package Description: 4-Pin Surface Mount Device, Body 6.5 x 4.6 mm, Pitch 2.54 mm; Datasheet Version: Rev. 2.8, 11/2015; Package Reference: MDIP 4L; Manufacturer URL: https://www.fairchildsemi.com/; Current - Output / Channel: 50mA; Turn On / Turn Off Time (Typ): -; Operating Temperature: -55°C~110°C; Datasheet URL: https://www.fairchildsemi.com/datasheets/FO/FOD817D.pdf; Package URL: https://www.fairchildsemi.com/package-drawings/N0/N04C.pdf
U6 = CMP-0366-01028-2: Adjustable Precision Shunt Regulator, 34 ppm / degC, 100 mA, 0 to 70 degC, 3-pin SOT-23 (DBZ), Green (RoHS & no Sb/Br); Manufacturer: Texas Instruments; Min Iz for Regulation(uA): 600; Rating: Catalog; Initial Accuracy @ 25/deg C(%): 1; VO Adj(Min)(V): 2.495; Temp Coeff(Typ)(ppm/ degree C): 34; VO Adj(Max)(V): 36; Iout/Iz(Max)(mA): 100; SubFamily: Shunt Voltage Reference; PartNumber: TL431ACDBZR; PackageReference: DBZ0003A; ComponentLink1URL: http://www.ti.com/; Mounting Technology: Surface Mount; ComponentLink2Description: Datasheet; ComponentLink3URL: http://www.ti.com/litv/pdf/mpds108a; ComponentLink2URL: http://www.ti.com/general/docs/lit/getliterature.tsp?genericPartNumber=TL431A&fileType=pdf; PackageVersion: 4203227/B; Code_JEDEC: TO-236; PackageDescription: 3-Pin Plastic Small Outline, Body 2.92 x 1.3 mm, Pitch 0.95 mm; DatasheetVersion: SLVS543M; Eco-Plan: Green (RoHS & no Sb/Br); ComponentLink1Description: Manufacturer URL; ComponentLink3Description: Package Specification
VD1 VD4 = 10BQ100: Table: Diode; Part Number: 10BQ100; Device: 10BQ100
VD2 = SM6T200CA: Table: Diode; Part Number: SM6T200CA; Device: SM6T200CA
VD3 = US1M: Table: Diode; Part Number: US1M; Device: US1M
XP1 = KDJ01-8: Table: OTHER; Part Number: KDJ01-8; Device: KDJ01-8
VD5 = DF10S: PartNumber: DF10S
XS1 = DG306-021-12: PartNumber: DG306-021-12